# EAGLE design stmcanV4 (EAGLE 5.10)

## Sheet 1 of 2
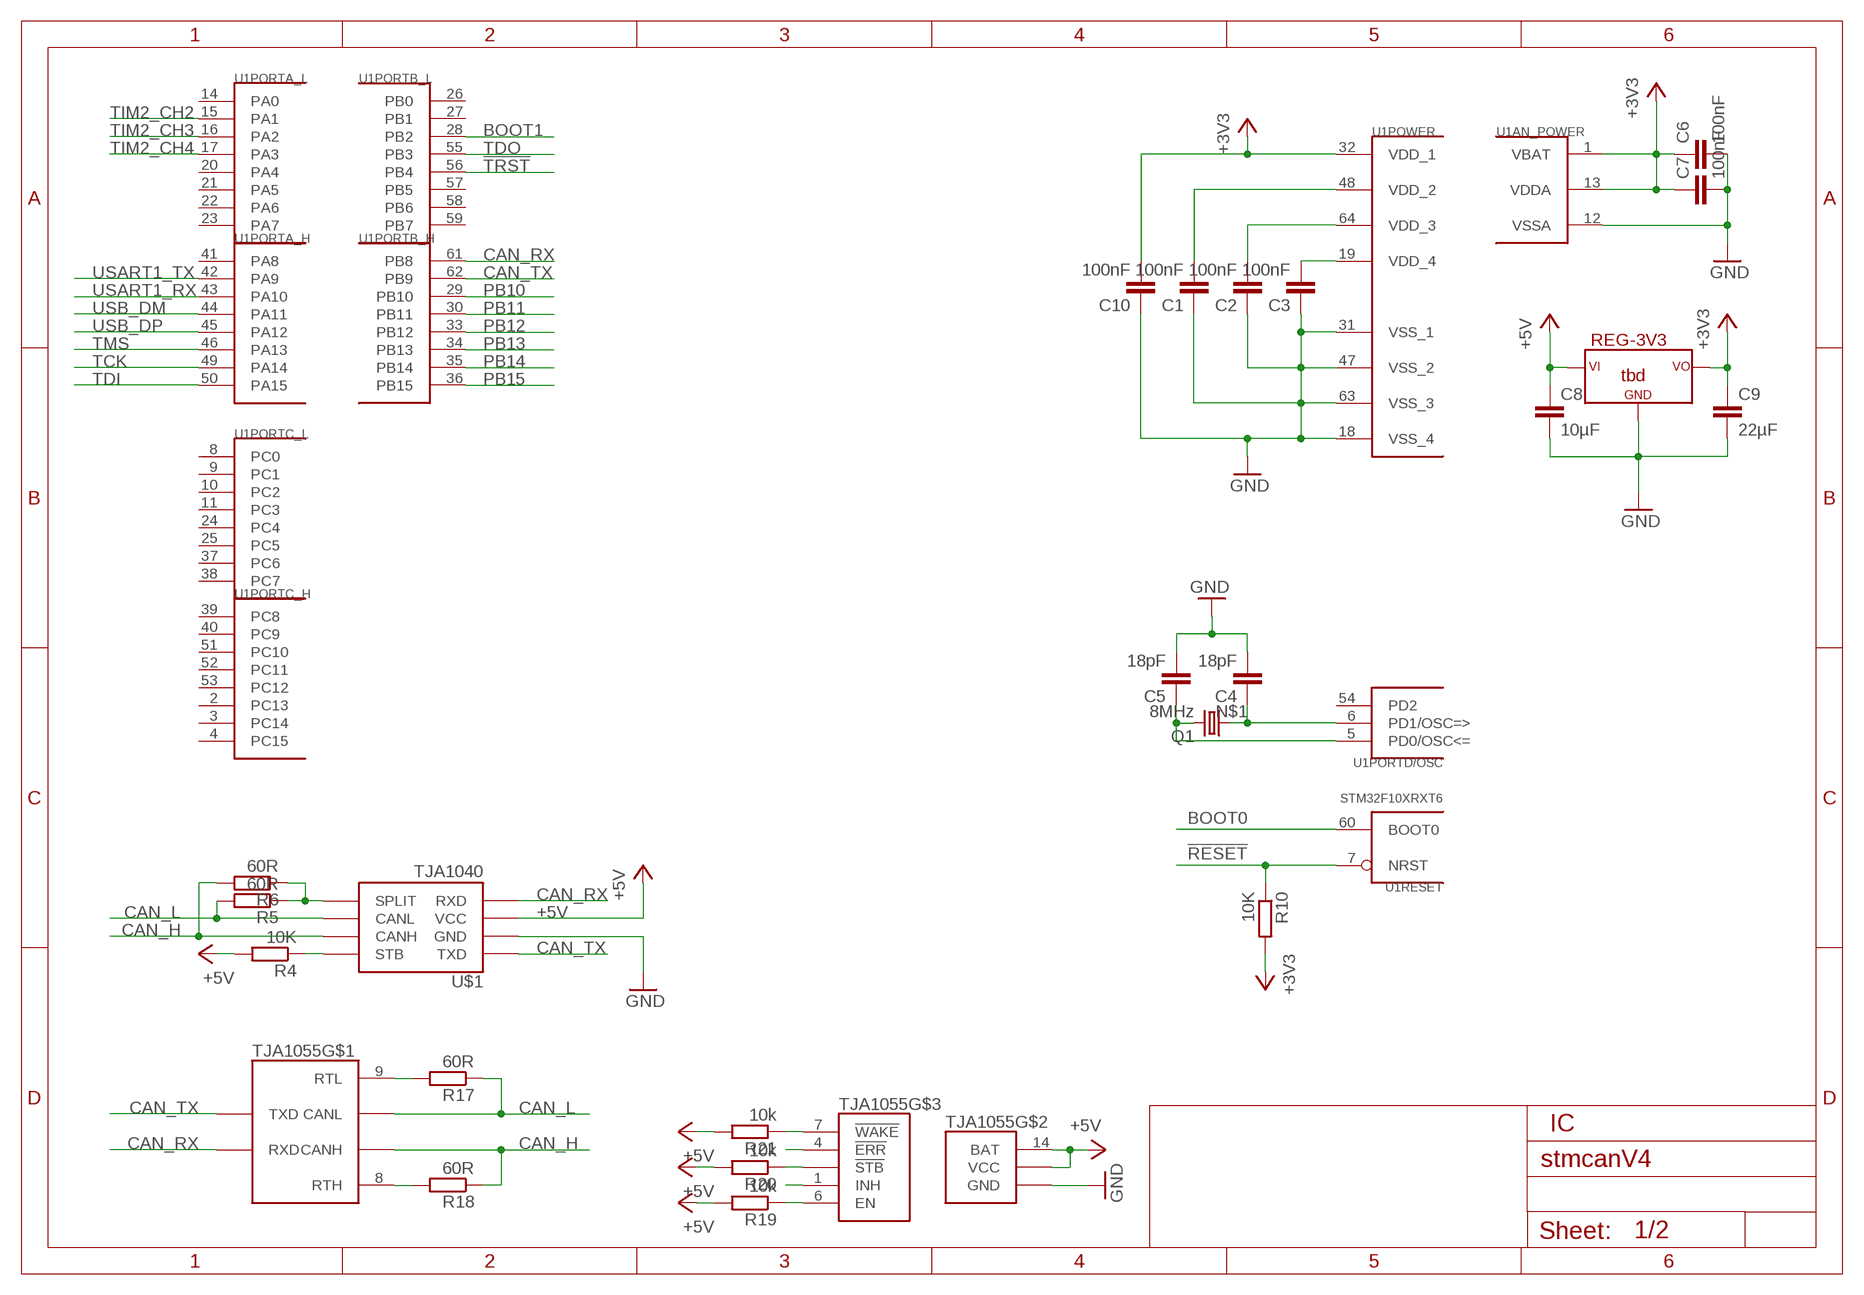
[diagram p0: schematic, sheet 1]

### Parts
C1  100nF  C0603  [C0603]
C2  100nF  C0603  [C0603]
C3  100nF  C0603  [C0603]
C4  18pF  C0603  [C0603]
C5  18pF  C0603  [C0603]
C6  100nF  C0603  [C0603]
C7  100nF  C0603  [C0603]
C8  10µF  C0805  [C0805]
C9  22µF  C0805  [C0805]
C10  100nF  C0603  [C0603]
Q1  8MHz  CRYSTALSMD  [HC49UP]
R4  10K  R0603  [R0603]
R5  60R  R0603  [R0603]
R6  60R  R0603  [R0603]
R10  10K  R0603  [R0603]
R17  60R  R0603  [R0603]
R18  60R  R0603  [R0603]
R19  10k  R0603  [R0603]
R20  10k  R0603  [R0603]
R21  10k  R0603  [R0603]
REG-3V3  tbd  VREGSOT23-3  [SOT23-3]
TJA1055  TJA1055  [SO14]
U1  STM32F10XRXT6  [TQFP64]
U$1  TJA1040  [SO08]

### Nets
!RESET: R10.1 U1.7(RESET:NRST) ; also sheet 2
!TRST: U1.56(PORTB_L:PB4) ; also sheet 2
+3V3: C6.1 C7.1 C9.1 C10.2 R10.2 REG-3V3.2 U1.1(AN_POWER:VBAT) U1.13(AN_POWER:VDDA) U1.32(POWER:VDD_1) ; also sheet 2
+5V: C8.1 R4.2 R19.2 R20.2 R21.2 REG-3V3.3 TJA1055.10(VCC) TJA1055.14(BAT) U$1.3(VCC) ; also sheet 2
BOOT0: U1.60(RESET:BOOT0) ; also sheet 2
BOOT1: U1.28(PORTB_L:PB2) ; also sheet 2
CAN_H: R6.2 R18.1 TJA1055.11(CANH) U$1.7(CANH) ; also sheet 2
CAN_L: R5.2 R17.1 TJA1055.12(CANL) U$1.6(CANL) ; also sheet 2
CAN_RX: TJA1055.3(RXD) U1.61(PORTB_H:PB8) U$1.4(RXD)
CAN_TX: TJA1055.2(TXD) U1.62(PORTB_H:PB9) U$1.1(TXD)
GND: C1.1 C2.1 C3.1 C4.2 C5.2 C6.2 C7.2 C8.2 C9.2 C10.1 REG-3V3.1 TJA1055.13(GND) U1.12(AN_POWER:VSSA) U1.18(POWER:VSS_4) U1.31(POWER:VSS_1) U1.47(POWER:VSS_2) U1.63(POWER:VSS_3) U$1.2(GND) ; also sheet 2
N$1: C4.1 Q1.1 U1.6(PORTD/OSC:PD1/OSC=>)
N$2: C5.1 Q1.2 U1.5(PORTD/OSC:PD0/OSC<=)
N$5: R5.1 R6.1 U$1.5(SPLIT)
N$8: R4.1 U$1.8(STB)
N$12: C3.2 U1.19(POWER:VDD_4)
N$14: R21.1 TJA1055.7(!WAKE)
N$15: TJA1055.4(!ERR)
N$16: R17.2 TJA1055.9(RTL)
N$17: C1.2 U1.48(POWER:VDD_2)
N$18: C2.2 U1.64(POWER:VDD_3)
N$19: R20.1 TJA1055.5(!STB)
N$20: TJA1055.1(INH)
N$21: R18.2 TJA1055.8(RTH)
N$22: R19.1 TJA1055.6(EN)
PB10: U1.29(PORTB_H:PB10) ; also sheet 2
PB11: U1.30(PORTB_H:PB11) ; also sheet 2
PB12: U1.33(PORTB_H:PB12) ; also sheet 2
PB13: U1.34(PORTB_H:PB13) ; also sheet 2
PB14: U1.35(PORTB_H:PB14) ; also sheet 2
PB15: U1.36(PORTB_H:PB15) ; also sheet 2
TCK: U1.49(PORTA_H:PA14) ; also sheet 2
TDI: U1.50(PORTA_H:PA15) ; also sheet 2
TDO: U1.55(PORTB_L:PB3) ; also sheet 2
TIM2_CH2: U1.15(PORTA_L:PA1) ; also sheet 2
TIM2_CH3: U1.16(PORTA_L:PA2) ; also sheet 2
TIM2_CH4: U1.17(PORTA_L:PA3) ; also sheet 2
TMS: U1.46(PORTA_H:PA13) ; also sheet 2
USART1_RX: U1.43(PORTA_H:PA10) ; also sheet 2
USART1_TX: U1.42(PORTA_H:PA9) ; also sheet 2
USB_DM: U1.44(PORTA_H:PA11) ; also sheet 2
USB_DP: U1.45(PORTA_H:PA12) ; also sheet 2
Unconnected: U1.2(PORTC_H:PC13) U1.3(PORTC_H:PC14) U1.4(PORTC_H:PC15) U1.8(PORTC_L:PC0) U1.9(PORTC_L:PC1) U1.10(PORTC_L:PC2) U1.11(PORTC_L:PC3) U1.14(PORTA_L:PA0) U1.20(PORTA_L:PA4) U1.21(PORTA_L:PA5) U1.22(PORTA_L:PA6) U1.23(PORTA_L:PA7) U1.24(PORTC_L:PC4) U1.25(PORTC_L:PC5) U1.26(PORTB_L:PB0) U1.27(PORTB_L:PB1) U1.37(PORTC_L:PC6) U1.38(PORTC_L:PC7) U1.39(PORTC_H:PC8) U1.40(PORTC_H:PC9) U1.41(PORTA_H:PA8) U1.51(PORTC_H:PC10) U1.52(PORTC_H:PC11) U1.53(PORTC_H:PC12) U1.54(PORTD/OSC:PD2) U1.57(PORTB_L:PB5) U1.58(PORTB_L:PB6) U1.59(PORTB_L:PB7)

### Notes on the sheet
- IC

## Sheet 2 of 2
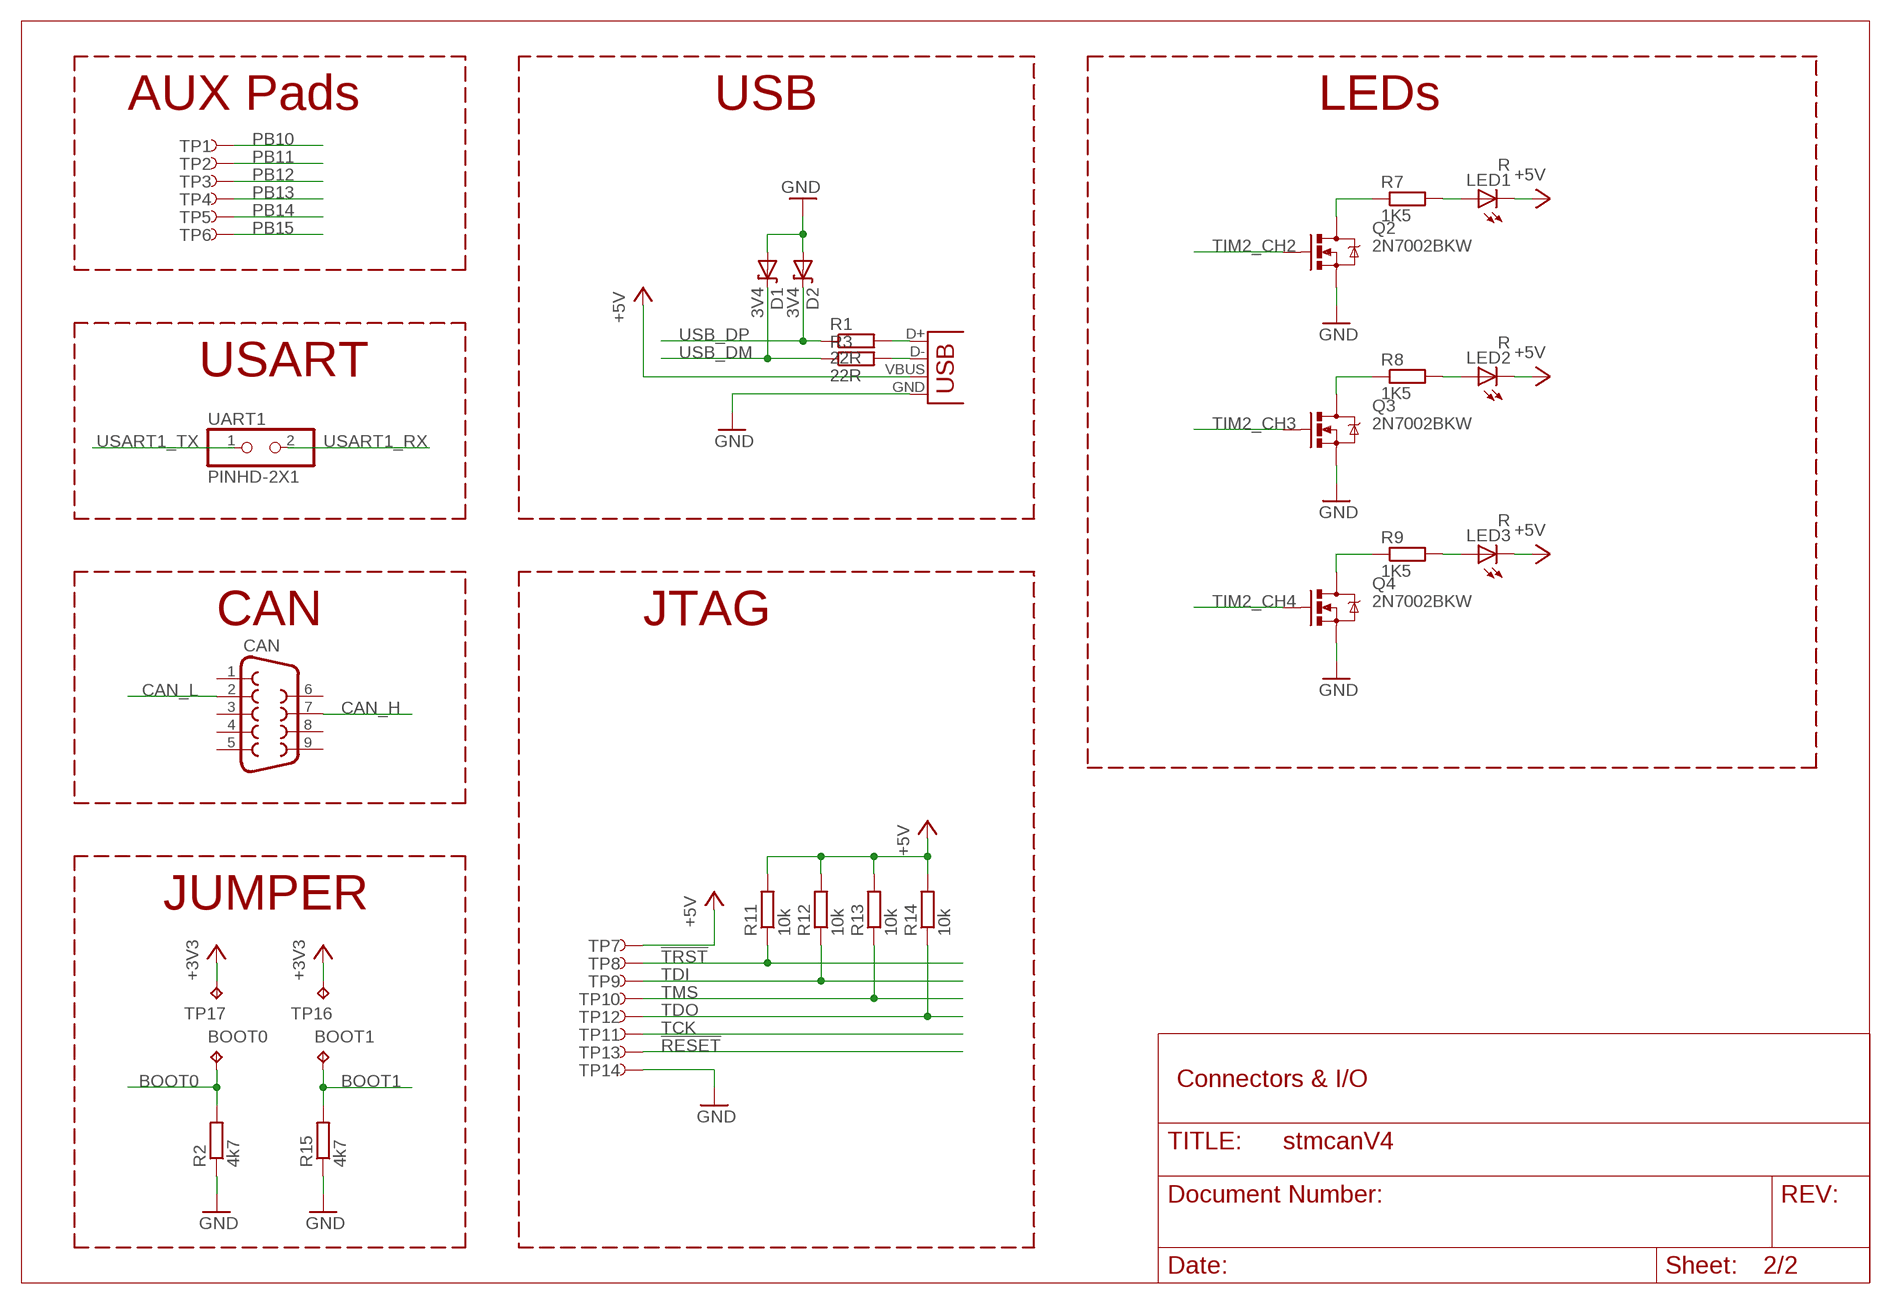
[diagram p1: schematic, sheet 2]

### Parts
BOOT0  TPTP10SQ  [TP10SQ]
BOOT1  TPTP10SQ  [TP10SQ]
CAN  F09D  [F09D]
D1  3V4  DIODE-ZENERSOT-23  [SOT23]
D2  3V4  DIODE-ZENERSOT-23  [SOT23]
LED1  R  LED0603  [LED-0603]
LED2  R  LED0603  [LED-0603]
LED3  R  LED0603  [LED-0603]
Q2  2N7002BKW  MOSFET-NCHANNELSMD  [SOT23-3]
Q3  2N7002BKW  MOSFET-NCHANNELSMD  [SOT23-3]
Q4  2N7002BKW  MOSFET-NCHANNELSMD  [SOT23-3]
R1  22R  R0603  [R0603]
R2  4k7  R0603  [R0603]
R3  22R  R0603  [R0603]
R7  1K5  R0603  [R0603]
R8  1K5  R0603  [R0603]
R9  1K5  R0603  [R0603]
R11  10k  R0603  [R0603]
R12  10k  R0603  [R0603]
R13  10k  R0603  [R0603]
R14  10k  R0603  [R0603]
R15  4k7  R0603  [R0603]
TP1  TEST-POINT3X5  [PAD.03X.05]
TP2  TEST-POINT3X5  [PAD.03X.05]
TP3  TEST-POINT3X5  [PAD.03X.05]
TP4  TEST-POINT3X5  [PAD.03X.05]
TP5  TEST-POINT3X5  [PAD.03X.05]
TP6  TEST-POINT3X5  [PAD.03X.05]
TP7  TEST-POINT3X5  [PAD.03X.05]
TP8  TEST-POINT3X5  [PAD.03X.05]
TP9  TEST-POINT3X5  [PAD.03X.05]
TP10  TEST-POINT3X5  [PAD.03X.05]
TP11  TEST-POINT3X5  [PAD.03X.05]
TP12  TEST-POINT3X5  [PAD.03X.05]
TP13  TEST-POINT3X5  [PAD.03X.05]
TP14  TEST-POINT3X5  [PAD.03X.05]
TP16  TPTP10SQ  [TP10SQ]
TP17  TPTP10SQ  [TP10SQ]
UART1  PINHD-2X1  [2X1]
USB  USBOLD  [USB-MINIB-OLD]

### Nets
!RESET: TP13.P$1 ; also sheet 1
!TRST: R11.1 TP8.P$1 ; also sheet 1
+3V3: TP16.TP TP17.TP ; also sheet 1
+5V: LED1.C LED2.C LED3.C R11.2 R12.2 R13.2 R14.2 TP7.P$1 USB.VBUS ; also sheet 1
BOOT0: BOOT0.TP R2.2 ; also sheet 1
BOOT1: BOOT1.TP R15.2 ; also sheet 1
CAN_H: CAN.7 ; also sheet 1
CAN_L: CAN.2 ; also sheet 1
GND: D1.1(A) D2.1(A) Q2.2(S) Q3.2(S) Q4.2(S) R2.1 R15.1 TP14.P$1 USB.GND ; also sheet 1
N$3: Q2.3(D) R7.1
N$4: R3.2 USB.D-
N$6: LED1.A R7.2
N$7: Q3.3(D) R8.1
N$9: LED2.A R8.2
N$10: Q4.3(D) R9.1
N$11: LED3.A R9.2
PB10: TP1.P$1 ; also sheet 1
PB11: TP2.P$1 ; also sheet 1
PB12: TP3.P$1 ; also sheet 1
PB13: TP4.P$1 ; also sheet 1
PB14: TP5.P$1 ; also sheet 1
PB15: TP6.P$1 ; also sheet 1
TCK: TP11.P$1 ; also sheet 1
TDI: R12.1 TP9.P$1 ; also sheet 1
TDO: R14.1 TP12.P$1 ; also sheet 1
TIM2_CH2: Q2.1(G) ; also sheet 1
TIM2_CH3: Q3.1(G) ; also sheet 1
TIM2_CH4: Q4.1(G) ; also sheet 1
TMS: R13.1 TP10.P$1 ; also sheet 1
USART1_RX: UART1.2 ; also sheet 1
USART1_TX: UART1.1 ; also sheet 1
USB: R1.2 USB.D+
USB_DM: D1.3(C) R3.1 ; also sheet 1
USB_DP: D2.3(C) R1.1 ; also sheet 1
Unconnected: CAN.1 CAN.3 CAN.4 CAN.5 CAN.6 CAN.8 CAN.9

### Notes on the sheet
- AUX Pads | USB | LEDs
- USART
- CAN | JTAG
- JUMPER
- Connectors & I/O

## Library data of the parts
BOOT0 BOOT1 TP16 TP17 = testpad:TP: Test pad
C1-C10 = bytewerk-rcl:C
CAN = bytewerk-con:F09: SUB-D; OC_FARNELL: unknown; OC_NEWARK: unknown
D1 D2 = bytewerk-diode:DIODE-ZENER: Zener Diode Production Part - 8199 3.4V Zener Voltage
LED1-LED3 = bytewerk-led:LED: LEDs Standard schematic elements and footprints for 5mm, 3mm, 1206, and 0603 sized LEDs. 5mm - Spark Fun Electronics SKU : COM-00529 (and others)
Q1 = bytewerk-crystal:CRYSTAL: Crystals Various standard crystals. Proven footprints. Spark Fun Electronics SKU : COM-00534
Q2-Q4 = bytewerk-transistor:MOSFET-NCHANNEL
R1-R15 R17-R21 = bytewerk-rcl:R
REG-3V3 = bytewerk-vreg:VREG
TJA1055 = bytewerk-network:TJA1055: LOW-Speed CAN Tranceiver
TP1-TP14 = bytewerk-con:TEST-POINT
U1 = stm32:STM32F10XRXT6: STM32F101/103 64pin LQFP
U$1 = bytewerk-network:TJA1040: CAN Tranceiver
UART1 = bytewerk-con:PINHD-2X1
USB = bytewerk-con:USB: USB Connectors USB-B-PTH is fully proven SKU : PRT-00139 USB-miniB is fully proven SKU : PRT-00587 USB-A-PCB is untested. USB-A-H is throughly reviewed, but untested. Spark Fun Electronics SKU : PRT-00437 USB-B-SMT is throughly reviewed, but untested. Needs silkscreen touching up. USB-A-S has not been used/tested USB-MB-H has not been used/tested

## Board
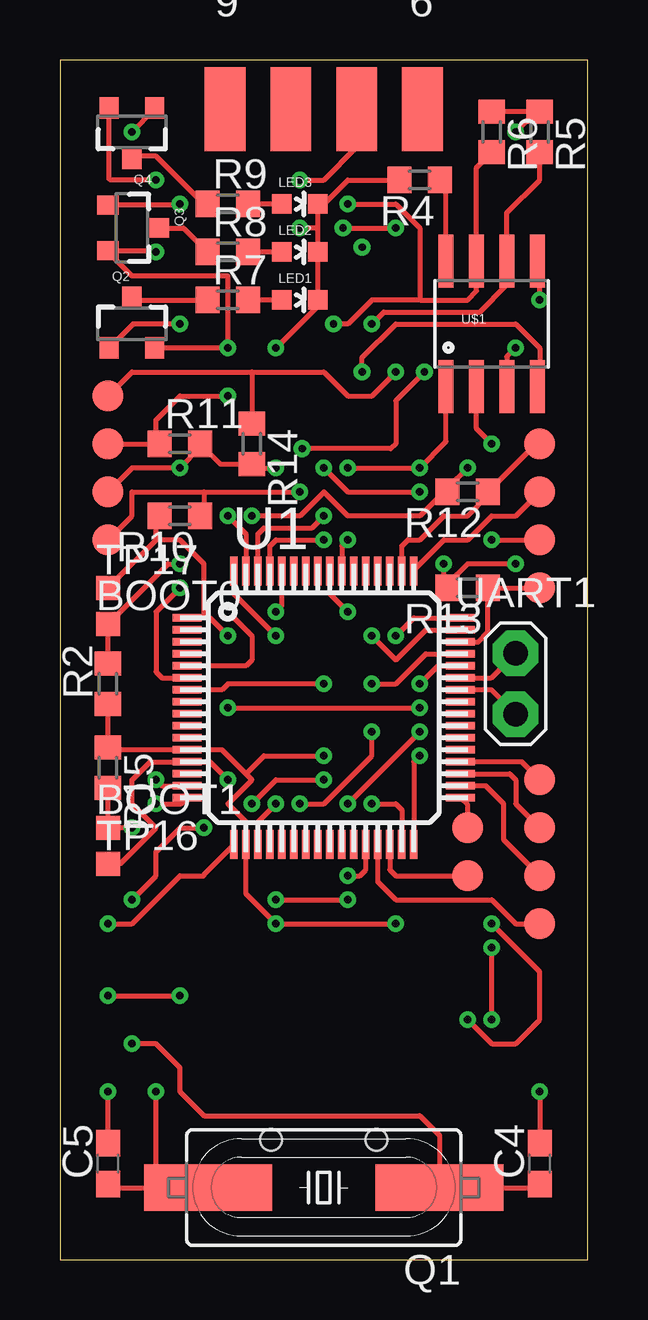
[diagram p2: board, top side]
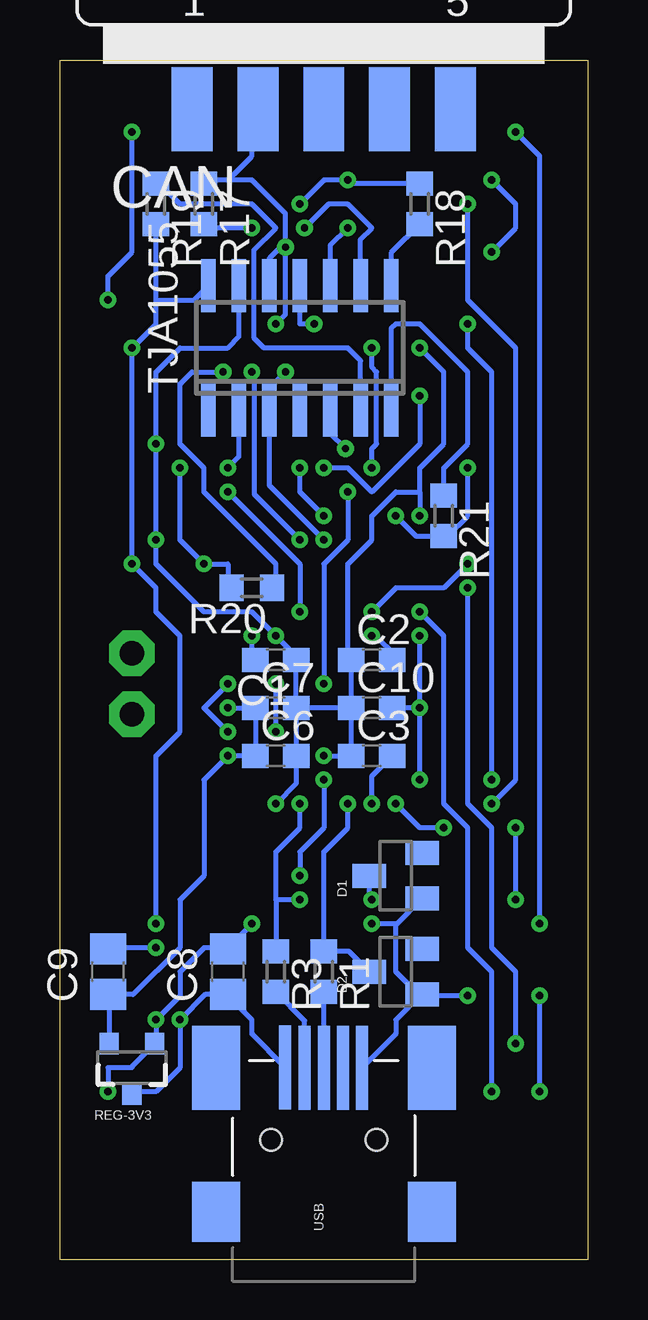
[diagram p3: board, bottom side, seen from below]

Size 22 x 50 mm. Coordinates in mm from the lower left corner, seen from the top.
Outline: 0,0 22,0 22,50 0,50 0,0
Copper layers (1*16): Top 0.035mm / dielectric 1.5mm / Bottom 0.035mm
Design rules "default *": minimum track width 0.2mm, minimum drill 0.3mm, track to track 0.2mm, track to pad 0.2mm, pad to pad 0.2mm, via to via 0.2mm, smd to smd 0mil, copper to edge 1mm, drill to drill 0.2mm, minimum pad ring 10mil, minimum via ring 8mil, stop-mask expansion 4mil, vias tented up to drill 0mil, thermal gap 10mil

### Footprints (pad centres in the part's own frame; a part is rotated, then mirrored left to right if it is on the bottom)
TP10SQ = smd 1 x 1: TP 0,0
C0603 = smd 1.1 x 1: 1 -0.85,0; 2 0.85,0
C0805 = smd 1.3 x 1.5: 1 -0.95,0; 2 0.95,0
F09D = smd 1.7 x 3.5: 1 -5.486,-6.045; 2 -2.743,-6.045; 3 0,-6.045; 4 2.743,-6.045; 5 5.486,-6.045 | smd 1.7 x 3.5 bottom: 6 -4.115,-6.045; 7 -1.372,-6.045; 8 1.372,-6.045; 9 4.115,-6.045
SOT23 = smd 1 x 1.4: 1 -0.95,-1.1; 2 0.95,-1.1; 3 0,1.1
LED-0603 = smd 0.8 x 0.8: A 0,-0.75; C 0,0.75
HC49UP = smd 5.334 x 1.93: 1 -4.826,0; 2 4.826,0
SOT23-3 = smd 0.8 x 0.9: 1 -0.95,-1; 2 0.95,-1; 3 0,1.1
R0603 = smd 1 x 1.1: 1 -0.85,0; 2 0.85,0
SO14 = smd 0.6 x 2.2: 1 -3.81,-2.6; 2 -2.54,-2.6; 3 -1.27,-2.6; 4 0,-2.6; 5 1.27,-2.6; 6 2.54,-2.6; 7 3.81,-2.6; 8 3.81,2.6; 9 2.54,2.6; 10 1.27,2.6; 11 0,2.6; 12 -1.27,2.6; 13 -2.54,2.6; 14 -3.81,2.6
PAD.03X.05 = smd 1.27 x 1.27: P$1 0,0
TQFP64 = smd 1.2 x 0.3: 1 -5.7,3.75; 2 -5.7,3.25; 3 -5.7,2.75; 4 -5.7,2.25; 5 -5.7,1.75; 6 -5.7,1.25; 7 -5.7,0.75; 8 -5.7,0.25; 9 -5.7,-0.25; 10 -5.7,-0.75; 11 -5.7,-1.25; 12 -5.7,-1.75; 13 -5.7,-2.25; 14 -5.7,-2.75; 15 -5.7,-3.25; 16 -5.7,-3.75; 33 5.7,-3.75; 34 5.7,-3.25; 35 5.7,-2.75; 36 5.7,-2.25; 37 5.7,-1.75; 38 5.7,-1.25; 39 5.7,-0.75; 40 5.7,-0.25; 41 5.7,0.25; 42 5.7,0.75; 43 5.7,1.25; 44 5.7,1.75; 45 5.7,2.25; 46 5.7,2.75; 47 5.7,3.25; 48 5.7,3.75 | smd 0.3 x 1.2: 17 -3.75,-5.7; 18 -3.25,-5.7; 19 -2.75,-5.7; 20 -2.25,-5.7; 21 -1.75,-5.7; 22 -1.25,-5.7; 23 -0.75,-5.7; 24 -0.25,-5.7; 25 0.25,-5.7; 26 0.75,-5.7; 27 1.25,-5.7; 28 1.75,-5.7; 29 2.25,-5.7; 30 2.75,-5.7; 31 3.25,-5.7; 32 3.75,-5.7; 49 3.75,5.7; 50 3.25,5.7; 51 2.75,5.7; 52 2.25,5.7; 53 1.75,5.7; 54 1.25,5.7; 55 0.75,5.7; 56 0.25,5.7; 57 -0.25,5.7; 58 -0.75,5.7; 59 -1.25,5.7; 60 -1.75,5.7; 61 -2.25,5.7; 62 -2.75,5.7; 63 -3.25,5.7; 64 -3.75,5.7
SO08 = smd 0.61 x 2.21: 1 -1.905,-2.616; 2 -0.635,-2.616; 3 0.635,-2.616; 4 1.905,-2.616; 5 1.905,2.616; 6 0.635,2.616; 7 -0.635,2.616; 8 -1.905,2.616
2X1 = drill 1.016 pad 1.88 octagon: 1 0,-1.27; 2 0,1.27
USB-MINIB-OLD = smd 2.5 x 2: 1 -3,-4.5; 2 -3,4.5 | smd 3.5 x 2: 3 3,-4.5; 4 3,4.5 | smd 3.5 x 0.5: D+ 3,0; D- 3,0.8; GND 3,-1.6; ID 3,-0.8; VBUS 3.01,1.61 | hole 0.9: 0,2.2; 0,-2.2

### Placement (x,y rotation side)
BOOT0  2,26.5 0 top
BOOT1  2,18 0 top
C1  13,25 180 bottom
C2  9,25 0 bottom
C3  9,21 0 bottom
C4  20,4 90 top
C5  2,4 90 top
C6  13,21 0 bottom
C7  13,23 0 bottom
C8  15,12 90 bottom
C9  20,12 90 bottom
C10  9,23 0 bottom
CAN  11,54 0 bottom
D1  8,16 90 bottom
D2  8,12 90 bottom
LED1  10,40 270 top
LED2  10,42 270 top
LED3  10,44 270 top
Q1  11,3 180 top
Q2  3,39 0 top
Q3  3,43 270 top
Q4  3,47 180 top
R1  11,12 270 bottom
R2  2,24 90 top
R3  13,12 270 bottom
R4  15,45 180 top
R5  20,47 270 top
R6  18,47 270 top
R7  7,40 0 top
R8  7,42 0 top
R9  7,44 0 top
R10  5,31 180 top
R11  5,34 0 top
R12  17,32 180 top
R13  17,28 180 top
R14  8,34 270 top
R15  2,20.5 270 top
R17  16,44 270 bottom
R18  7,44 270 bottom
R19  18,44 270 bottom
R20  14,28 180 bottom
R21  6,31 270 bottom
REG-3V3  19,8 180 bottom
TJA1055  12,38 0 bottom
TP1  20,14 270 top
TP2  17,16 270 top
TP3  17,18 270 top
TP4  20,16 270 top
TP5  20,18 270 top
TP6  20,20 270 top
TP7  2,32 0 top
TP8  2,34 180 top
TP9  20,34 180 top
TP10  20,28 180 top
TP11  20,32 180 top
TP12  2,36 180 top
TP13  2,30 180 top
TP14  20,30 180 top
TP16  2,16.5 0 top
TP17  2,28 0 top
U1  11,23 0 top
U$1  18,39 0 top
UART1  19,24 0 top
USB  11,5 90 bottom

### Tracks (layer width: path | path; a pad name or v marks a point on that pad's centre or on a via)
!RESET  (via drill 0.3)
  Top 0.2: U1.7 6.75,23.75 7,24 v11,24 | TP13.P$1 3,31 3,32 6,32 | R10.1 6,31.15 6,32 | 6,32 v10,32
  Bottom 0.2: v10,32 10,30 11,29 v11,24
!TRST  (via drill 0.3)
  Top 0.2: U1.56 11.25,27.75 v12,27 | TP8.P$1 R11.1 4,34.15 4,35 5,36 v7,36 | v15,32 12,32 v11,33
  Bottom 0.2: v12,27 12,29 v15,32 | v7,36 7,34 9,32 10,33 v11,33
+3V3  (via drill 0.3)
  Top 0.2: v15,21 14.75,20.75 U1.32 | 6,26.75 6.25,26.75 v7,26 | 6,26.75 U1.1 | v7,20 6.25,20.75 U1.13 3.75,20.75 3,20 3,19 4,18 2.5,16.5 TP16.TP | v7,23 v15,23 | TP17.TP 2.15,28 2.15,28.15 4,30 | R10.2 4,30.85 4,30 | 4,30 5,30 6,29 6,26.75
  Bottom 0.2: v15,23 C7.1 C6.1 v15,21 16,20 16,16 17,15 17,13 18.95,11.05 C9.1 19.95,11 REG-3V3.2 | v7,23 C10.2 | v7,20 v7,23 | v7,23 v7,26
+5V  (via drill 0.3)
  Top 0.2: v17,10 18,9 19,9 20,10 20,12 v18,14 | v19,29 17,29 16.15,28.15 | 16.15,28.15 R13.2 | 16.15,28.15 16,28.3 v16,29 | v8,31 10,31 11,32 12,31 15,31 16,32 R12.2 16.15,32.15 v17,33 | TP7.P$1 3,33 v5,33 5.85,33.85 R11.2 6.7,33.15 R14.2 8.15,33 v9,33 | U$1.3 18.64,37.63 v19,38 | v9,38 10.75,39.75 LED1.C LED2.C 10.75,43 | R4.2 12,45 11,44 LED3.C 10.75,43 | 10.75,43 v10,43
  Bottom 0.2: USB.VBUS 14,9.4 14,10 15,11 C8.1 15.95,11.05 v17,10 17,8 18,7 18.9,7 REG-3V3.3 19,7 | v18,14 18,21 17,22 17,26 18,27 18,28 v19,29 v19,38 18,39 18,40 | v8,31 7.15,30.15 R21.2 5.85,30.15 5,31 v5,33 | R20.2 15,28 15,29 v16,29 17,30 v17,33 | TJA1055.14 16.41,40 18,40 | v9,33 9,33.8 8.8,34 8.8,37 9,37.2 v9,38 | TJA1055.10 10.73,42.27 v10,43 | 18,40 R19.2
BOOT0  (via drill 0.3)
  Top 0.2: R2.2 BOOT0.TP 4.5,29 v5,29 | v9,27 9.25,27.25 U1.60
  Bottom 0.2: v9,27 8,28 6,28 v5,29
BOOT1  (via drill 0.3)
  Top 0.2: R15.2 BOOT1.TP v3,18 | v11,20 9,20 v8,19 | v6,18 5,18 4,17 4,16 v3,15 | U1.28 12.75,16.25 12.5,16 v12,16
  Bottom 0.2: v12,16 12,17 11,18 v11,20 | v8,19 7,18 v6,18 | v3,15 v3,18
CAN_H  (via drill 0.3)
  Top 0.2: v10,45 11,45 12.37,46.37 CAN.7 | 15,40 17,40 17.36,40.37 U$1.7 17.36,45.52 R6.2 | 15,40 15,43 14,44 v12,44 | 15,40 13,40 12,39 v11.4,39
  Bottom 0.2: R18.1 9.85,44.85 v10,45 11,45 v12,44 | TJA1055.11 12,39 v11.4,39
CAN_L  (via drill 0.3)
  Top 0.2: v13,39 13.5,39.5 17.5,39.5 18.64,40.63 U$1.6 18.64,43.63 20,45 R5.2
  Bottom 0.2: CAN.2 14,47.7 14,46 15,45 | TJA1055.12 13.27,41.73 12.8,42.2 v12.6,42.2 | v12.6,42.2 12.6,39.4 v13,39 | 15,45 14,45 12.6,43.6 v12.6,42.2 | 15,45 15.85,45 R17.1
CAN_RX  (via drill 0.3)
  Top 0.2: U1.61 8.75,29.75 9,30 v11,30 | U$1.4 20,36.48 20,38 19,39 14,39 12.6,37.6 v12.6,37
  Bottom 0.2: v12.6,37 13.27,36.33 TJA1055.3 13.27,32.27 v11,30
CAN_TX  (via drill 0.3)
  Top 0.2: U1.62 8.25,30.25 8.5,30.5 10.5,30.5 v11,31 | U$1.1 16.09,34.09 v15,33 v12,33
  Bottom 0.2: v11,31 12,32 v12,33 | v15,33 14.54,33.46 TJA1055.2
GND  (via drill 0.3)
  Top 0.2: 7.75,20.25 6.75,21.25 U1.12 2.1,21.25 R15.1 R2.1 | 7.75,20.25 8.5,21 v11,21 | v13,19 14,19 14.25,18.75 U1.31 | v14,14 v9,14 7.75,15.25 U1.18 7.75,18.25 7,19 8,20 7.75,20.25 | v18,10 v18,13 | v2,11 v5,11 | C5.2 v2,7 | v18,30 TP14.P$1 | v20,7 C4.2 | v18,34 17.36,34.63 U$1.2 | Q2.2 v7,38 7,41 3,41 2,42 Q3.2 3.95,42.05 v4,42 | U1.63 7.75,30.25 v7,31 | Q4.2 2.05,45.05 2.1,45 v4,45 | U1.47 15.25,26.25 14,25 v13,26
  Bottom 0.2: C7.2 C1.1 12.15,25.15 v13,26 14,27 16,27 18,29 v18,30 v18,34 18,37 17,38 15,38 14.54,38.46 TJA1055.13 | C7.2 C6.2 12.15,19.85 v13,19 | C10.1 C2.1 10,25.15 10,29 9,30 9,31 8,32 7,32 | C10.1 C3.1 v11,21 | C10.1 C7.2 | USB.GND 8,9.4 8,10 6.95,11.05 D2.1 | 8,14 7.95,14 D1.1 | 8,14 8,12 7.05,11.05 D2.1 | 8,14 v9,14 | v14,14 15,13 C8.2 15.05,13 16,13 17,12 17,11 v18,10 18,9.05 REG-3V3.1 19,8.05 19,8 20,8 v20,7 | D2.1 6.9,11 v5,11 | C9.2 19.95,13 v18,13 | v2,7 v2,11 | 7,32 v7,31 | 7,32 7,33 6,34 6,37 v7,38 | v4,42 3,43 3,44 v4,45
N$1  (via drill 0.3)
  Top 0.2: C4.1 19.85,3 Q1.1 15.83,5.17 15,6 6,6 5,7 5,8 4,9 v3,9 | v5,28 4,27 4,24.5 4.25,24.25 U1.6
  Bottom 0.2: v3,9 3,12 4,13 4,18 5,19 v5,28
N$2  (via drill 0.3)
  Top 0.2: C5.1 2.15,3 4,3 | 4,3 Q1.2 | 4,3 v4,7 | v7,27 8,26 8,25 7.75,24.75 U1.5
  Bottom 0.2: v4,7 4,12 5,13 5,18 6,19 6,26 v7,27
N$3
  Top 0.2: R7.1 3.1,40 Q2.3
N$4
  Bottom 0.2: R3.2 11.8,9.95 USB.D-
N$5  (via drill 0.3)
  Top 0.2: R6.1 R5.1 19.85,47.85 v19,47 | v20,40 20,41.52 U$1.5
  Bottom 0.2: v19,47 19,42 20,41 v20,40
N$6
  Top 0.2: LED1.A R7.2
N$7
  Top 0.2: Q3.3 5.15,43 R8.1
N$8
  Top 0.2: R4.1 16.09,44.76 U$1.8
N$9
  Top 0.2: LED2.A R8.2
N$10
  Top 0.2: R9.1 6,44 4,46 3.1,46 Q4.3
N$11
  Top 0.2: LED3.A R9.2
N$12  (via drill 0.3)
  Top 0.2: v9,19 8.25,18.25 U1.19
  Bottom 0.2: C3.2 9,20.15 v9,19
N$14
  Bottom 0.2: TJA1055.7 8.19,38.81 8,39 7,39 5,37 5,34 6,33 R21.1
N$16  (via drill 0.3)
  Top 0.2: v11.8,43 v14,43
  Bottom 0.2: TJA1055.9 9.46,42.54 9,43 10,44 10.8,44 v11.8,43 | v14,43 15.85,43 R17.2
N$17  (via drill 0.3)
  Top 0.2: v14,26 14.75,26.75 U1.48
  Bottom 0.2: C1.2 14,25 v14,26
N$18  (via drill 0.3)
  Top 0.2: U1.64 7.25,27.75 v9,26
  Bottom 0.2: C2.2 8,25.15 8.85,26 v9,26
N$19  (via drill 0.3)
  Top 0.2: v10.1,33.8 13.8,33.8 14,34 14,35.8 v15.2,37
  Bottom 0.2: R20.1 13,28.15 13,29 16,32 16,33 17,34 17,36.5 16.5,37 v15.2,37 | 10.73,36.43 TJA1055.5 10.73,34.43 v10.1,33.8
N$21
  Bottom 0.2: R18.2 8.19,41.96 TJA1055.8
N$22
  Bottom 0.2: TJA1055.6 9.46,37.46 10,38 13.5,38 13.9,38.4 13.9,42.1 13,43 14,44 17,44 17.85,44.85 R19.1
PB10
  Top 0.2: U1.29 13.25,15.75 14,15 18,15 19,14 TP1.P$1
PB11
  Top 0.2: U1.30 13.75,16.25 14,16 TP2.P$1
PB12
  Top 0.2: U1.33 17,18.95 TP3.P$1
PB13
  Top 0.2: U1.34 17.75,19.75 18.5,19 18.5,17.5 TP4.P$1
PB14
  Top 0.2: U1.35 18.75,20.25 19,20 19,19 TP5.P$1
PB15
  Top 0.2: U1.36 19.25,20.75 TP6.P$1
TCK
  Top 0.2: TP11.P$1 19,31 18,31 17,30 16,30 14.75,28.75 U1.49
TDI
  Top 0.2: TP9.P$1 19.85,34 R12.1 17.85,31.85 17,31 16,31 15,30 14.5,30 14.25,29.75 U1.50
TDO  (via drill 0.3)
  Top 0.2: U1.55 11.75,29.75 v12,30 | TP12.P$1 3,37 8,37 | 8,37 R14.1 | v14,37 13,36 12,36 11,37 8,37
  Bottom 0.2: v14,37 13.9,36.9 13.9,31.9 v12,30
TIM2_CH2  (via drill 0.3)
  Top 0.2: U1.15 4.25,19.75 v4,20 | Q2.1 3.05,39 v5,39
  Bottom 0.2: v4,20 4,37 5,38 v5,39
TIM2_CH3  (via drill 0.3)
  Top 0.2: U1.16 5.05,19 v4,19 | Q3.1 4.95,43.95 v5,44
  Bottom 0.2: v4,19 3,20 3,38 5,40 v5,44
TIM2_CH4  (via drill 0.3)
  Top 0.2: U1.17 6,16.05 6,16 5,16 3,14 v2,14 | v3,47 3.95,47.95 Q4.1
  Bottom 0.2: v2,14 2,46 v3,47
TMS
  Top 0.2: U1.46 17.45,25.75 17.85,26.15 R13.1 TP10.P$1
USART1_RX
  Top 0.2: UART1.2 17.98,24.25 U1.43
USART1_TX
  Top 0.2: UART1.1 17.98,23.75 U1.42
USB
  Bottom 0.2: USB.D+ R1.2
USB_DM  (via drill 0.3)
  Top 0.2: v9,15 v12,15 | v12,19 v15,22 | v15,24 15.75,24.75 U1.44
  Bottom 0.2: 13,15 13,17 12,18 v12,19 | 13,15 R3.1 | v12,15 13,15 | v9,15 9.1,15.1 D1.3 | v15,22 16,23 v15,24
USB_DP  (via drill 0.3)
  Top 0.2: U1.45 15.25,25.25 14,24 v13,24 | v13,22 13,21 11,19 v10,19
  Bottom 0.2: D2.3 9.95,12.85 R1.1 11,17 10,18 v10,19 | v13,22 v13,24